# EAGLE schematic GPS (EAGLE 8.5.1)
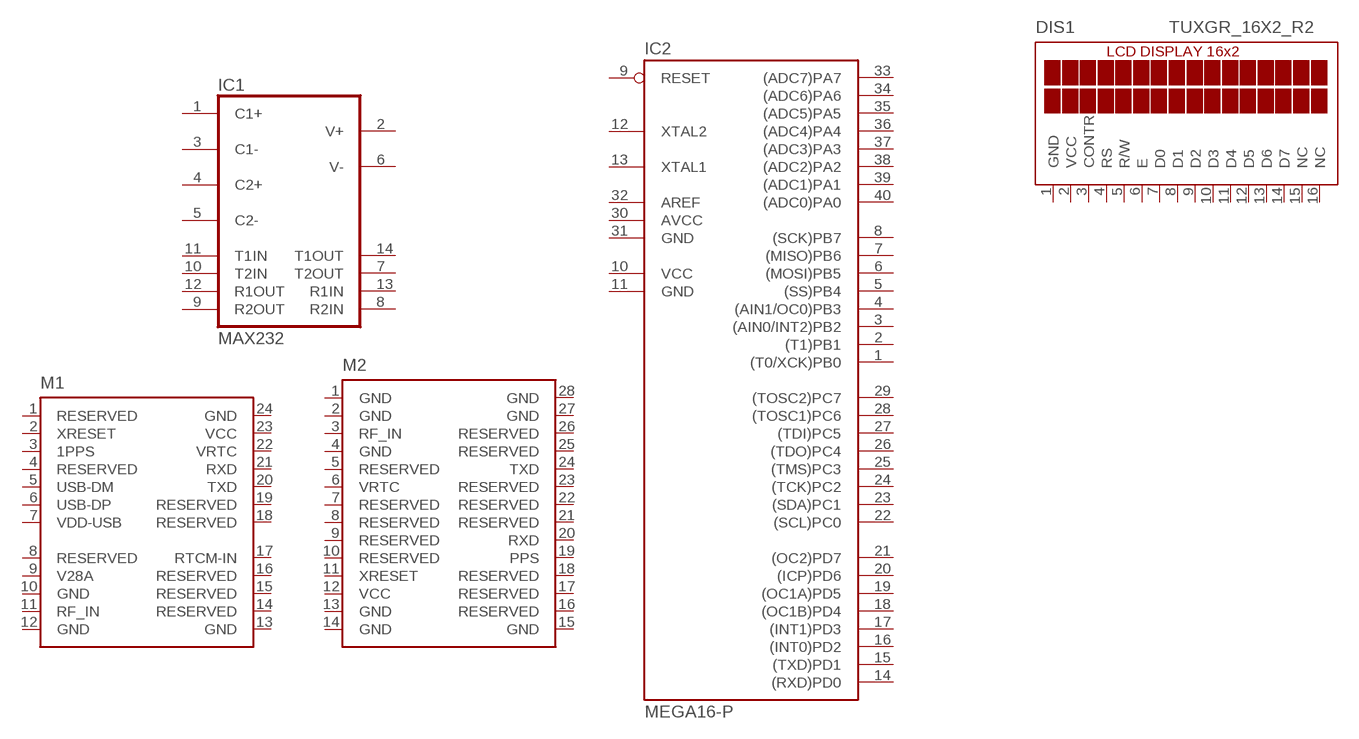
[diagram p0: schematic, sheet 1]

## Parts
DIS1  TUXGR_16X2_R2  [TUXGR_16X2_R2]
IC1  MAX232  [DIL16]
IC2  MEGA16-P  [DIL40]
M1  C1216_CONDOR-SMD  [1216]
M2  C1919C_CONDOR-SMD  [1919]
Unconnected: DIS1.3(CONTR) DIS1.4(RS) DIS1.5(R/W) DIS1.6(E) DIS1.7(D0) DIS1.8(D1) DIS1.9(D2) DIS1.10(D3) DIS1.11(D4) DIS1.12(D5) DIS1.13(D6) DIS1.14(D7) DIS1.15(NC) DIS1.16(NC) IC1.1(C1+) IC1.2(V+) IC1.3(C1-) IC1.4(C2+) IC1.5(C2-) IC1.6(V-) IC1.7(T2OUT) IC1.8(R2IN) IC1.9(R2OUT) IC1.10(T2IN) IC1.11(T1IN) IC1.12(R1OUT) IC1.13(R1IN) IC1.14(T1OUT) IC2.1((T0/XCK)PB0) IC2.2((T1)PB1) IC2.3((AIN0/INT2)PB2) IC2.4((AIN1/OC0)PB3) IC2.5((SS)PB4) IC2.6((MOSI)PB5) IC2.7((MISO)PB6) IC2.8((SCK)PB7) IC2.9(RESET) IC2.12(XTAL2) IC2.13(XTAL1) IC2.14((RXD)PD0) IC2.15((TXD)PD1) IC2.16((INT0)PD2) IC2.17((INT1)PD3) IC2.18((OC1B)PD4) IC2.19((OC1A)PD5) IC2.20((ICP)PD6) IC2.21((OC2)PD7) IC2.22((SCL)PC0) IC2.23((SDA)PC1) IC2.24((TCK)PC2) IC2.25((TMS)PC3) IC2.26((TDO)PC4) IC2.27((TDI)PC5) IC2.28((TOSC1)PC6) IC2.29((TOSC2)PC7) IC2.32(AREF) IC2.33((ADC7)PA7) IC2.34((ADC6)PA6) IC2.35((ADC5)PA5) IC2.36((ADC4)PA4) IC2.37((ADC3)PA3) IC2.38((ADC2)PA2) IC2.39((ADC1)PA1) IC2.40((ADC0)PA0) M1.1(RESERVED) M1.2(XRESET) M1.3(1PPS) M1.4(RESERVED) M1.5(USB-DM) M1.6(USB-DP) M1.7(VDD-USB) M1.8(RESERVED) M1.9(V28A) M1.11(RF_IN) M1.14(RESERVED) M1.15(RESERVED) M1.16(RESERVED) M1.17(RTCM-IN) M1.18(RESERVED) M1.19(RESERVED) M1.20(TXD) M1.21(RXD) M1.22(VRTC) M2.3(RF_IN) M2.5(RESERVED) M2.6(VRTC) M2.7(RESERVED) M2.8(RESERVED) M2.9(RESERVED) M2.10(RESERVED) M2.11(XRESET) M2.16(RESERVED) M2.17(RESERVED) M2.18(RESERVED) M2.19(PPS) M2.20(RXD) M2.21(RESERVED) M2.22(RESERVED) M2.23(RESERVED) M2.24(TXD) M2.25(RESERVED) M2.26(RESERVED)

## Power pins joined to a net without a drawn wire
AVCC: IC2.30(AVCC)
GND: DIS1.1(GND) IC1.15(GND) IC2.11(GND) IC2.31(GND) M1.10(GND) M1.12(GND) M1.13(GND) M1.24(GND) M2.1(GND) M2.2(GND) M2.4(GND) M2.13(GND) M2.14(GND) M2.15(GND) M2.27(GND) M2.28(GND)
VCC: DIS1.2(VCC) IC1.16(VCC) IC2.10(VCC) M1.23(VCC) M2.12(VCC)

## Library data of the parts
DIS1 = display-lcd:TUXGR_16X2_R2: Tuxgraphics LCD display 16x2 characters reflective, without background light Source: tuxgr_12x2_r2.pdf; OC_FARNELL: unknown; OC_NEWARK: unknown
IC1 = maxim:MAX232: RS232 TRANSCEIVER; MF: MAXIM; MPN: MAX232ACPE+; OC_FARNELL: 9723773; OC_NEWARK: 68K4544
IC2 = atmel:MEGA16-P: MICROCONTROLLER 16 Kbytes FLASH 1 kbytes SRAM 512 bytes EEPROM USART 8-channel 10 bit ADC Source: avr.lbr; MPN: ATMEGA16-16PU; OC_FARNELL: 9171142; OC_NEWARK: 01M6885
M1 = trimble:C1216_CONDOR: Condor C1216 GPS Receiver Module SMD GPS Receiver module, made by Trimble Navigation Ltd, Embedded Systems Group <http://www.trimble.com/embeddedsystems/> Partnumber: 68676-10 Datasheet, User Manual and Tools <http://www.trimble.com/embeddedsystems/condor-gps-module.aspx> Created by Trimble Navigation Ltd, Author: Christian Voit <mailto:christian_voit@trimble.com?subject=Trimble Eagle Library>
M2 = trimble:C1919C_CONDOR: Condor C1919C GPS Receiver Module SMD GPS Receiver module, made by Trimble Navigation Ltd, Embedded Systems Group <http://www.trimble.com/embeddedsystems/> Partnumber: 67650-20 Datasheet, User Manual and Tools <http://www.trimble.com/embeddedsystems/condor-gps-module.aspx> Created by Trimble Navigation Ltd, Author: Christian Voit <mailto:christian_voit@trimble.com?subject=Trimble Eagle Library>